# Altium schematic sheet Fanout Buffer.SchDoc: Clock Buffer
size A4; SheetNumber: 4; SheetTotal: 5
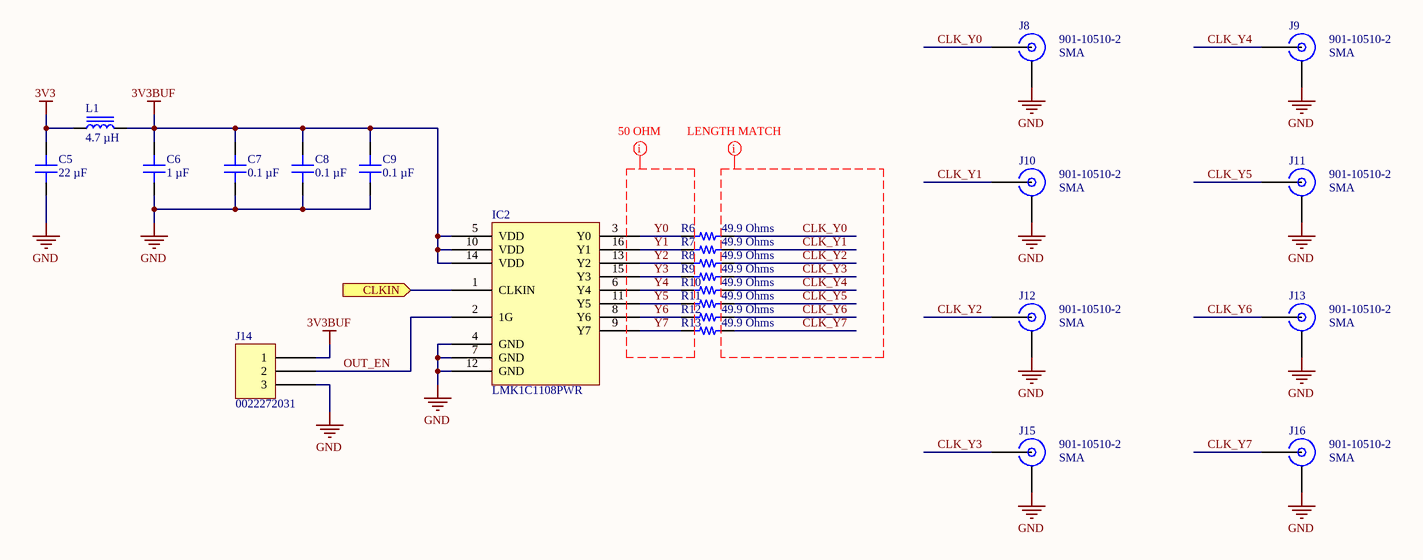
[diagram p0: Fanout Buffer.SchDoc]

## Parts
C5  22 µF  [CAP 0603_1608]
C6  1 µF  [CAP 0603_1608]
C7  0.1 µF  [CAP 0603_1608]
C8  0.1 µF  [CAP 0603_1608]
C9  0.1 µF  [CAP 0603_1608]
IC2  LMK1C1108PWR  [TI TSSOP-16 PW0016A]
J8  901-10510-2  Connector Style: SMA  [AMPHENOL 901-10510-2]
J9  901-10510-2  Connector Style: SMA  [AMPHENOL 901-10510-2]
J10  901-10510-2  Connector Style: SMA  [AMPHENOL 901-10510-2]
J11  901-10510-2  Connector Style: SMA  [AMPHENOL 901-10510-2]
J12  901-10510-2  Connector Style: SMA  [AMPHENOL 901-10510-2]
J13  901-10510-2  Connector Style: SMA  [AMPHENOL 901-10510-2]
J14  0022272031  [MOLEX KK 0022272031]
J15  901-10510-2  Connector Style: SMA  [AMPHENOL 901-10510-2]
J16  901-10510-2  Connector Style: SMA  [AMPHENOL 901-10510-2]
L1  4.7 µH  [WURTH WE-LQS 3015]
R6  49.9 Ohms  [RES 0402_1005]
R7  49.9 Ohms  [RES 0402_1005]
R8  49.9 Ohms  [RES 0402_1005]
R9  49.9 Ohms  [RES 0402_1005]
R10  49.9 Ohms  [RES 0402_1005]
R11  49.9 Ohms  [RES 0402_1005]
R12  49.9 Ohms  [RES 0402_1005]
R13  49.9 Ohms  [RES 0402_1005]

## Ports
CLKIN (in, see Overview[3B])

## Nets
3V3: C5.2 L1.1
3V3BUF: C6.2 C7.1 C8.1 C9.1 IC2.5(VDD) IC2.10(VDD) IC2.14(VDD) J14.1 L1.2
GND: C5.1 C6.1 C7.2 C8.2 C9.2 IC2.4(GND) IC2.7(GND) IC2.12(GND) J8.G(GND) J9.G(GND) J10.G(GND) J11.G(GND) J12.G(GND) J13.G(GND) J14.3 J15.G(GND) J16.G(GND)
CLK_Y0: J8.S(SIGNAL) R6.2
CLK_Y1: J10.S(SIGNAL) R7.2
CLK_Y2: J12.S(SIGNAL) R8.2
CLK_Y3: J15.S(SIGNAL) R9.2
CLK_Y4: J9.S(SIGNAL) R10.2
CLK_Y5: J11.S(SIGNAL) R11.2
CLK_Y6: J13.S(SIGNAL) R12.2
CLK_Y7: J16.S(SIGNAL) R13.2
CLKIN: IC2.1(CLKIN) ; port CLKIN
OUT_EN: IC2.2(1G) J14.2
Y0: IC2.3(Y0) R6.1
Y1: IC2.16(Y1) R7.1
Y2: IC2.13(Y2) R8.1
Y3: IC2.15(Y3) R9.1
Y4: IC2.6(Y4) R10.1
Y5: IC2.11(Y5) R11.1
Y6: IC2.8(Y6) R12.1
Y7: IC2.9(Y7) R13.1

## Layout directives
net class 50R: Y0, Y1, Y2, Y3, Y4, Y5, Y6, Y7
net class FANOUT: CLK_Y0, CLK_Y1, CLK_Y2, CLK_Y3, CLK_Y4, CLK_Y5, CLK_Y6, CLK_Y7

## Notes on the sheet
- Title
- Size:
- Date:
- A4
- Number:
- Time:
- Revision:
- Sheet
- of
- File:

## Library data of the parts
C5 = CL10A226MP8NUNE: CAP CER 22UF 10V X5R 0603; manufacturer: Samsung Electro-Mechanics; Tolerance: ±20%; Part Number: CL10A226MP8NUNE; Value: 22 µF; Applications: General Purpose; Capacitance: 22 µF; componentlink1description: Datasheet; componentlink1url: http://www.samsungsem.com/kr/support/product-search/mlcc/CL10A226MP8NUNE.jsp; componentlink2description: DigiKey Link; componentlink2url: https://www.digikey.com/en/products/detail/samsung-electro-mechanics/CL10A226MP8NUNE/3886932; Device Package: 0603 (1608 Metric); lastupdated: 02/11/2023 19:13:02; Lifecycle Status: Active; Minimum Order: 1; Mounting Type: Surface Mount, MLCC; Operating Temperature: -55°C ~ 85°C; Package / Case: 0603 (1608 Metric); packaging: TapeAndReel; partid: 11458; Part Status: Active; price: 0.02; series: CL; Size / Dimension: 0.063" L x 0.031" W (1.60mm x 0.80mm); Supplier 1: DigiKey; Supplier Part Number 1: 1276-1274-1-ND; Temperature Coefficient: X5R; Thickness (Max): 0.035" (0.90mm); Voltage - Rated: 10V
C6 = GCM188R71E105KA64D: CAP CER 1UF 25V X7R 0603; manufacturer: Murata Electronics; Tolerance: ±10%; Part Number: GCM188R71E105KA64D; Value: 1 µF; Applications: Automotive; Capacitance: 1 µF; componentlink1description: Datasheet; componentlink1url: https://www.murata.com/~/media/webrenewal/support/library/catalog/products/capacitor/mlcc/c03e.ashx?la=en-us; componentlink2description: DigiKey Link; componentlink2url: https://www.digikey.com/en/products/detail/murata-electronics/GCM188R71E105KA64D/4903956; Device Package: 0603 (1608 Metric); lastupdated: 20/08/2023 19:09:04; Lifecycle Status: Active; Minimum Order: 1; Mounting Type: Surface Mount, MLCC; Operating Temperature: -55°C ~ 125°C; Package / Case: 0603 (1608 Metric); packaging: TapeAndReel; partid: 6762; Part Status: Active; price: 0.03; Ratings: AEC-Q200; series: GCM; Size / Dimension: 0.063" L x 0.031" W (1.60mm x 0.80mm); Supplier 1: DigiKey; Supplier Part Number 1: 490-10673-1-ND; Temperature Coefficient: X7R; Thickness (Max): 0.035" (0.90mm); Voltage - Rated: 25V
C7-C9 = CL10B104KB8NNNC: CAP CER 0.1UF 50V X7R 0603; manufacturer: Samsung Electro-Mechanics; Tolerance: ±10%; Part Number: CL10B104KB8NNNC; Value: 0.1 µF; Applications: General Purpose; Capacitance: 0.1 µF; componentlink1description: Datasheet; componentlink1url: http://www.samsungsem.com/kr/support/product-search/mlcc/CL10B104KB8NNNC.jsp; componentlink2description: DigiKey Link; componentlink2url: https://www.digikey.com/en/products/detail/samsung-electro-mechanics/CL10B104KB8NNNC/3886658; Device Package: 0603 (1608 Metric); lastupdated: 02/11/2023 19:13:06; Lifecycle Status: Active; Minimum Order: 1; Mounting Type: Surface Mount, MLCC; Operating Temperature: -55°C ~ 125°C; Package / Case: 0603 (1608 Metric); packaging: TapeAndReel; partid: 9788; Part Status: Active; price: 0.01; series: CL; Size / Dimension: 0.063" L x 0.031" W (1.60mm x 0.80mm); Supplier 1: DigiKey; Supplier Part Number 1: 1276-1000-1-ND; Temperature Coefficient: X7R; Thickness (Max): 0.035" (0.90mm); Voltage - Rated: 50V
IC2 = LMK1C1108PWR: IC CLK BUFFER 1:8 250MHZ 16TSSOP; Manufacturer: Texas Instruments; Differential - Input:Output: No/No; Input: LVCMOS; Number of Circuits: 1; Voltage - Supply: 1.71V ~ 1.89V, 2.375V ~ 2.625V, 3.135V ~ 3.465V; ComponentLink2Description: DigiKey Link; ComponentLink2URL: https://www.digikey.com/en/products/detail/texas-instruments/LMK1C1108PWR/13627117; Frequency - Max: 250 MHz; LastUpdated: 17/03/2024 20:29:12; Lifecycle Status: Active; Part Number: LMK1C1108PWR; Minimum Order: 1; Mounting Type: Surface Mount; Operating Temperature: -40°C ~ 105°C; Output: LVCMOS; Packaging: TapeAndReel; Part Status: Active; Price: 1.83; Ratio - Input:Output: 1:8; Series: -; Supplier 1: DigiKey; Supplier Part Number 1: 296-LMK1C1108PWRCT-ND; Supplier Device Package: 16-TSSOP; Type: Clock Buffer
J8-J13 J15 J16 = 901-10510-2: CONN SMA JACK R/A 50OHM EDGE MNT; Manufacturer: Amphenol RF; Connector Type: Jack, Female Socket; Contact Termination: Solder; Frequency - Max: 26.5 GHz; Number of Ports: 1; Part Number: 901-10510-2; ComponentLink1Description: Datasheet; ComponentLink1URL: http://www.amphenolrf.com/index.php/downloads/dl/file/id/7684/product/0/sma_high_frequency_connectors.pdf; ComponentLink2Description: DigiKey Link; ComponentLink2URL: https://www.digikey.com/en/products/detail/amphenol-rf/901-10510-2/6051059; Fastening Type: Threaded; Impedance: 50Ohm; LastUpdated: 29/03/2023 22:34:51; Lifecycle Status: Active; Minimum Order: 1; Mounting Type: Board Edge, End Launch; Through Hole, Right Angle; Packaging: Bulk; Part Status: Active; Price: 7.52; Series: -; Shield Termination: Solder; Supplier 1: DigiKey; Supplier Part Number 1: ARF2496-ND
J14 = 0022272031: CONN HEADER VERT 3POS 2.54MM; Manufacturer: Molex; Contact Length - Mating: 0.295" (7.49mm); Contact Length - Post: 0.140" (3.56mm); Material Flammability Rating: UL94 V-0; Number of Positions: 3; Number of Positions Loaded: All; Overall Contact Length: 0.560" (14.22mm); Pitch - Mating: 0.100" (2.54mm); Shrouding: Shrouded - 1 Wall; Style: Board to Cable/Wire; Part Number: 0022272031; ComponentLink1Description: Datasheet; ComponentLink1URL: https://www.molex.com/pdm_docs/sd/022272031_sd.pdf; ComponentLink2Description: DigiKey Link; ComponentLink2URL: http://digikey.com/product-detail/en/molex/0022272031/WM4112-ND/1130578; Connector Type: Header; Contact Finish - Mating: Tin; Contact Finish - Post: Tin; Contact Finish Thickness - Mating: 100.0µin (2.54µm); Contact Material: Brass; Contact Shape: Square; Contact Type: Male Pin; Fastening Type: Friction Lock; Insulation Color: Natural; Insulation Height: 0.461" (11.70mm); Insulation Material: Polyamide (PA), Nylon; LastUpdated: 12/01/2020 23:51:54; Lifecycle Status: Active; Minimum Order: 1; Mounting Type: Through Hole; Number of Rows: 1; Packaging: Bulk; PartId: 77; Part Status: Active; Price: 0.37; Series: KK 6410; Supplier 1: DigiKey; Supplier Part Number 1: WM4112-ND; Termination: Solder
L1 = 74404032047: FIXED IND 4.7UH 1.3A 96 MOHM SMD; Manufacturer: Würth Elektronik; Current - Saturation: 1.2A; DC Resistance (DCR): 96mOhm; Frequency - Self Resonant: 50MHz; Inductance Frequency - Test: 100 kHz; Material - Core: Ferrite; Shielding: Shielded; Tolerance: ±20%; Type: Drum Core, Wirewound; Part Number: 74404032047; ComponentLink1Description: Datasheet; ComponentLink1URL: https://katalog.we-online.de/pbs/datasheet/74404032047.pdf; ComponentLink2Description: DigiKey Link; ComponentLink2URL: https://www.digikey.com/en/products/detail/würth-elektronik/74404032047/4865640; Current Rating (Amps): 1.3 A; Device Package: Nonstandard; Height - Seated (Max): 0.059" (1.50mm); Inductance: 4.7 µH; LastUpdated: 16/03/2024 20:32:51; Lifecycle Status: Active; Minimum Order: 1; Mounting Type: Surface Mount; Operating Temperature: -40°C ~ 125°C; Package / Case: Nonstandard; Packaging: TapeAndReel; PartId: 7005; Part Status: Active; Price: 0.66; Ratings: AEC-Q200; Series: WE-LQS; Size / Dimension: 0.118" L x 0.118" W (3.00mm x 3.00mm); Supplier 1: DigiKey; Supplier Part Number 1: 732-5495-1-ND; Supplier Device Package: 3015; Value: 4.7 µH
R6-R13 = ERJ-2RKF49R9X: RES SMD 49.9 OHM 1% 1/10W 0402; Manufacturer: Panasonic Electronic Components; Power (Watts): 0.1W, 1/10W; Temperature Coefficient: ±100ppm/°C; Part Number: ERJ-2RKF49R9X; Value: 49.9 Ohms; ComponentLink1Description: Datasheet; ComponentLink1URL: https://industrial.panasonic.com/cdbs/www-data/pdf/RDA0000/AOA0000C304.pdf; ComponentLink2Description: DigiKey Link; ComponentLink2URL: https://www.digikey.com/en/products/detail/panasonic-electronic-components/ERJ-2RKF49R9X/192382; Composition: Thick Film; Device Package: 0402 (1005 Metric); Features: Automotive AEC-Q200; Height - Seated (Max): 0.016" (0.40mm); LastUpdated: 09/02/2024 20:29:34; Lifecycle Status: Active; Minimum Order: 1; Number of Terminations: 2; Operating Temperature: -55°C ~ 155°C; Package / Case: 0402 (1005 Metric); Packaging: CutTape; PartId: 17623; Part Status: Active; Price: 0.01; Ratings: AEC-Q200; Resistance: 49.9 Ohms; Series: ERJ-2RK; Size / Dimension: 0.039" L x 0.020" W (1.00mm x 0.50mm); Supplier 1: DigiKey; Supplier Part Number 1: P49.9LCT-ND; Supplier Device Package: 0402; Tolerance: ±1%